# Altium schematic sheet Highlevel.SchDoc
size A4
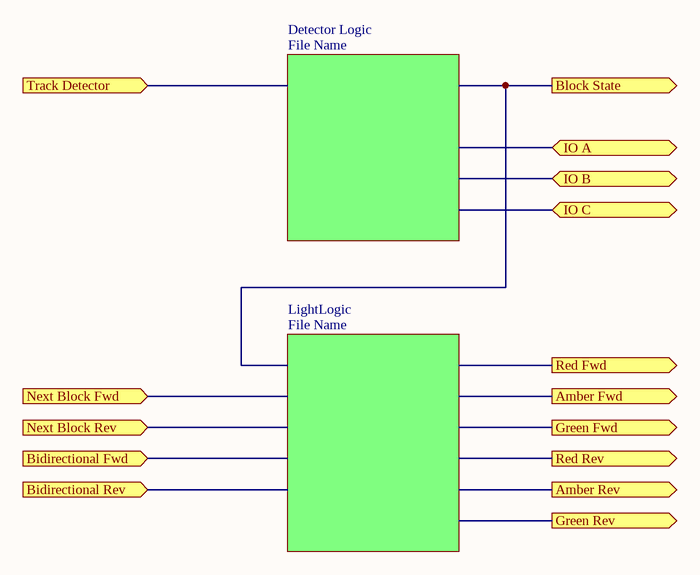
[diagram p0: Highlevel.SchDoc]

## Sub-sheets
Detector Logic = File Name: no entries
LightLogic = File Name: no entries

## Ports
Amber Fwd (out), Amber Rev (out), Bidirectional Fwd (in), Bidirectional Rev (in), Block State (out), Green Fwd (out), Green Rev (out), IO A (bidir), IO B (bidir), IO C (bidir), Next Block Fwd (in), Next Block Rev (in), Red Fwd (out), Red Rev (out), Track Detector (in)